# EAGLE design v1 (EAGLE 7.7.0)
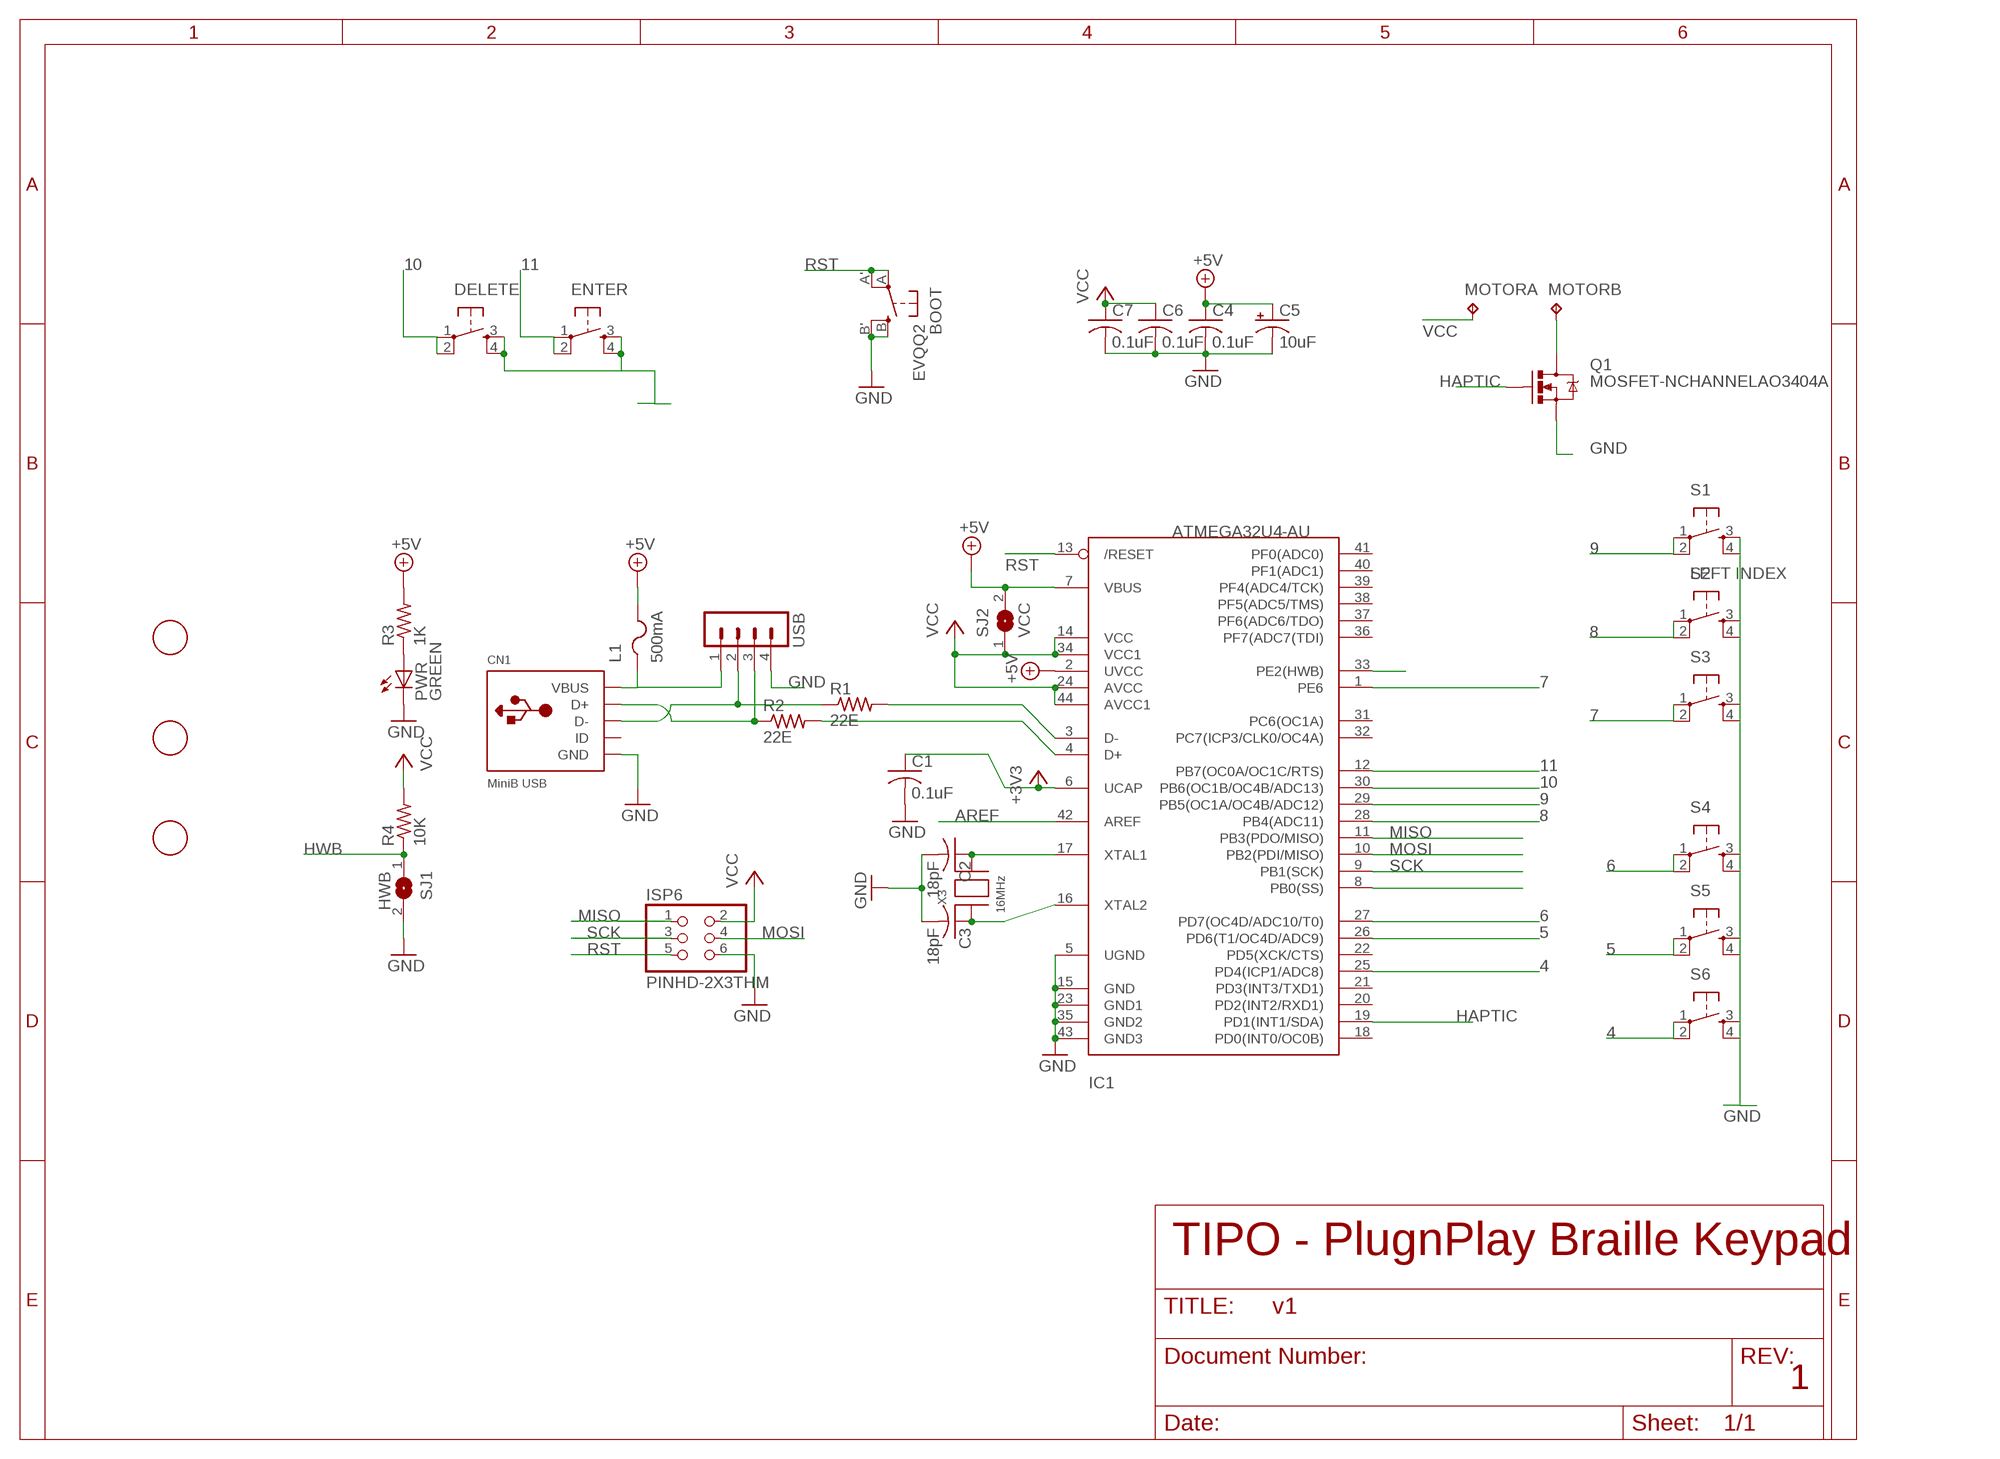
[diagram p0: schematic, sheet 1]

## Parts
BOOT  EVQQ2  [EVQ-Q2]
C1  0.1uF  C-USC0805K  [C0805K]
C2  18pF  C-USC0805K  [C0805K]
C3  18pF  C-USC0805K  [C0805K]
C4  0.1uF  C-USC0805K  [C0805K]
C5  10uF  CPOL-USA/3216-18R  [A/3216-18R]
C6  0.1uF  C-USC0805K  [C0805K]
C7  0.1uF  C-USC0805K  [C0805K]
CN1  MiniB USB  USBMINIB  [USB-MINIB]
DELETE  TAC_SWITCHPTH  [TACTILE-PTH]
ENTER  TAC_SWITCHPTH  [TACTILE-PTH]
IC1  ATMEGA32U4-AU  [TQFP44]
ISP6  PINHD-2X3THM  [ISP6]
L1  500mA  PTCFUSE-1206  [R1206]
MOTOR  TP2P2-38-17  [P2-38-17]
PWR  GREEN  LEDCHIPLED_0805  [CHIPLED_0805]
Q1  MOSFET-NCHANNELAO3404A  [SOT23-3]
R1  22E  R-US_R0805  [R0805]
R2  22E  R-US_R0805  [R0805]
R3  1K  R-US_R0805  [R0805]
R4  10K  R-US_R0805  [R0805]
S1  LEFT INDEX  TAC_SWITCHPTH  [TACTILE-PTH]
S2  TAC_SWITCHPTH  [TACTILE-PTH]
S3  TAC_SWITCHPTH  [TACTILE-PTH]
S4  TAC_SWITCHPTH  [TACTILE-PTH]
S5  TAC_SWITCHPTH  [TACTILE-PTH]
S6  TAC_SWITCHPTH  [TACTILE-PTH]
SJ1  HWB  SJ  [SJ]
SJ2  VCC  SJ  [SJ]
U$1  FIDUCIAL  [FIDUCIAL_1MM]
U$2  FIDUCIAL  [FIDUCIAL_1MM]
U$6  FIDUCIAL  [FIDUCIAL_1MM]
USB  MA04-1  [MA04-1]
X3  16MHz  XTALNX5032  [NX5032]

## Nets
4: IC1.25(PD4(ICP1/ADC8)) S6.1 S6.2
5: IC1.26(PD6(T1/OC4D/ADC9)) S5.1 S5.2
6: IC1.27(PD7(OC4D/ADC10/T0)) S4.1 S4.2
7: IC1.1(PE6) S3.1 S3.2
8: IC1.28(PB4(ADC11)) S2.1 S2.2
9: IC1.29(PB5(OC1A/OC4B/ADC12)) S1.1 S1.2
10: DELETE.1 DELETE.2 IC1.30(PB6(OC1B/OC4B/ADC13))
11: ENTER.1 ENTER.2 IC1.12(PB7(OC0A/OC1C/RTS))
+3V3: C1.1 IC1.6(UCAP)
+5V: C4.1 C5.+ IC1.2(UVCC) IC1.7(VBUS) L1.2 R3.2 SJ2.2
AREF: IC1.42(AREF)
GND: BOOT.B'(S1) BOOT.B(S) C1.2 C2.2 C3.2 C4.2 C5.- C6.2 C7.2 CN1.GND DELETE.3 DELETE.4 ENTER.3 ENTER.4 IC1.5(UGND) IC1.15(GND) IC1.23(GND1) IC1.35(GND2) IC1.43(GND3) ISP6.6 PWR.C Q1.2(S) S1.3 S1.4 S2.3 S2.4 S3.3 S3.4 S4.3 S4.4 S5.3 S5.4 S6.3 S6.4 SJ1.2 USB.4
HAPTIC: IC1.19(PD1(INT1/SDA)) Q1.1(G)
HWB: IC1.33(PE2(HWB)) R4.1 SJ1.1
MISO: IC1.11(PB3(PDO/MISO)) ISP6.1
MOSI: IC1.10(PB2(PDI/MISO)) ISP6.4
N$1: PWR.A R3.1
N$2: CN1.D+ R2.1 USB.3
N$3: IC1.3(D-) R1.2
N$4: IC1.4(D+) R2.2
N$5: CN1.D- R1.1 USB.2
N$7: MOTOR.TP-2 Q1.3(D)
N$8: C2.1 IC1.17(XTAL1) X3.P$2
N$9: C3.1 IC1.16(XTAL2) X3.P$1
PB0: IC1.8(PB0(SS))
RST: BOOT.A'(P1) BOOT.A(P) IC1.13(/RESET) ISP6.5
SCK: IC1.9(PB1(SCK)) ISP6.3
VBUS: CN1.VBUS L1.1 USB.1
VCC: C6.1 C7.1 IC1.14(VCC) IC1.24(AVCC) IC1.34(VCC1) IC1.44(AVCC1) ISP6.2 MOTOR.TP-1 R4.2 SJ2.1
Unconnected: CN1.ID IC1.18(PD0(INT0/OC0B)) IC1.20(PD2(INT2/RXD1)) IC1.21(PD3(INT3/TXD1)) IC1.22(PD5(XCK/CTS)) IC1.31(PC6(OC1A)) IC1.32(PC7(ICP3/CLK0/OC4A)) IC1.36(PF7(ADC7(TDI)) IC1.37(PF6(ADC6/TDO)) IC1.38(PF5(ADC5/TMS)) IC1.39(PF4(ADC4/TCK)) IC1.40(PF1(ADC1)) IC1.41(PF0(ADC0))

## Notes on the sheet
- TIPO - PlugnPlay Braille Keypad
- 1

## Library data of the parts
BOOT = adaprog:EVQQ2
C1-C4 C6 C7 = adafruit:C-US: CAPACITOR, American symbol
C5 = adafruit:CPOL-US: POLARIZED CAPACITOR, American symbol
CN1 = adafruit:USB: USB Connectors USBMINIB - Surface Mount Female Mini-B USB Connector 4UConnector: 06564 By microbuilder.eu Thru-hole RA Female Mini-B USB Connector 4UConnector: 18732 By ladyada.net
DELETE ENTER S1-S6 = SparkFun-Retired:TAC_SWITCH: Momentary Switch Button commonly used for reset or general input. Spark Fun Electronics SKU : COM-00097 SMT- SWCH-08247
IC1 = adaprog:ATMEGA32U4
ISP6 = adaprog:PINHD-2X3
L1 = adafruit:PTCFUSE: PTC fuses, resettable thermistors
MOTOR = testpad:TP2: Test pad
PWR = adafruit:LED: LED OSRAM: - CHIPLED LG R971, LG N971, LY N971, LG Q971, LY Q971, LO R971, LY R971 LH N974, LH R974 LS Q976, LO Q976, LY Q976 LO Q996 - Hyper CHIPLED LW Q18S LB Q993, LB Q99A, LB R99A - SideLED LS A670, LO A670, LY A670, LG A670, LP A670 LB A673, LV A673, LT A673, LW A673 LH A674 LY A675 LS A676, LA A676, LO A676, LY A676, LW A676 LS A679, LY A679, LG A679 - Hyper Micro SIDELED® LS Y876, LA Y876, LO Y876, LY Y876 LT Y87S - SmartLED LW L88C, LW L88S LB L89C, LB L89S, LG L890 LS L89K, LO L89K, LY L89K LS L896, LA L896, LO L896, LY L896 - TOPLED LS T670, LO T670, LY T670, LG T670, LP T670 LSG T670, LSP T670, LSY T670, LOP T670, LYG T670 LG T671, LOG T671, LSG T671 LB T673, LV T673, LT T673, LW T673 LH T674 LS T676, LA T676, LO T676, LY T676, LB T676, LH T676, LSB T676, LW T676 LB T67C, LV T67C, LT T67C, LS T67K, LO T67K, LY T67K, LW E67C LS E67B, LA E67B, LO E67B, LY E67B, LB E67C, LV E67C, LT E67C LW T67C LS T679, LY T679, LG T679 LS T770, LO T770, LY T770, LG T770, LP T770 LB T773, LV T773, LT T773, LW T773 LH T774 LS E675, LA E675, LY E675, LS T675 LS T776, LA T776, LO T776, LY T776, LB T776 LHGB T686 LT T68C, LB T68C - Hyper Mini TOPLED® LB M676 - Mini TOPLED Santana® LG M470 LS M47K, LO M47K, LY M47K Source: http://www.osram.convergy.de/
Q1 = SparkFun-DiscreteSemi:MOSFET-NCHANNEL: Common NMOSFET Parts MFG P/N Store ID Prod ID FDD8780 TRANS-09984 SI7820DN TRANS-11055 FDS6630A IC-08089 2N7002PW TRANS-11151 FQP30N06L COM-10213 TRANS-10060 BSS123LT1G TRANS-08345 BSS138 TRANS-00830 BS170 2N7000; PROD_ID: TRAN-12988
R1-R4 = adafruit:R-US_: RESISTOR, American symbol
SJ1 SJ2 = jumper:SJ: SMD solder JUMPER
U$1 U$2 U$6 = adafruit:FIDUCIAL: For use by pick and place machines to calibrate the vision/machine, 1mm By microbuilder.eu
USB = con-lstb:MA04-1: PIN HEADER; OC_FARNELL: unknown; OC_NEWARK: unknown
X3 = adaprog:XTAL

## Board
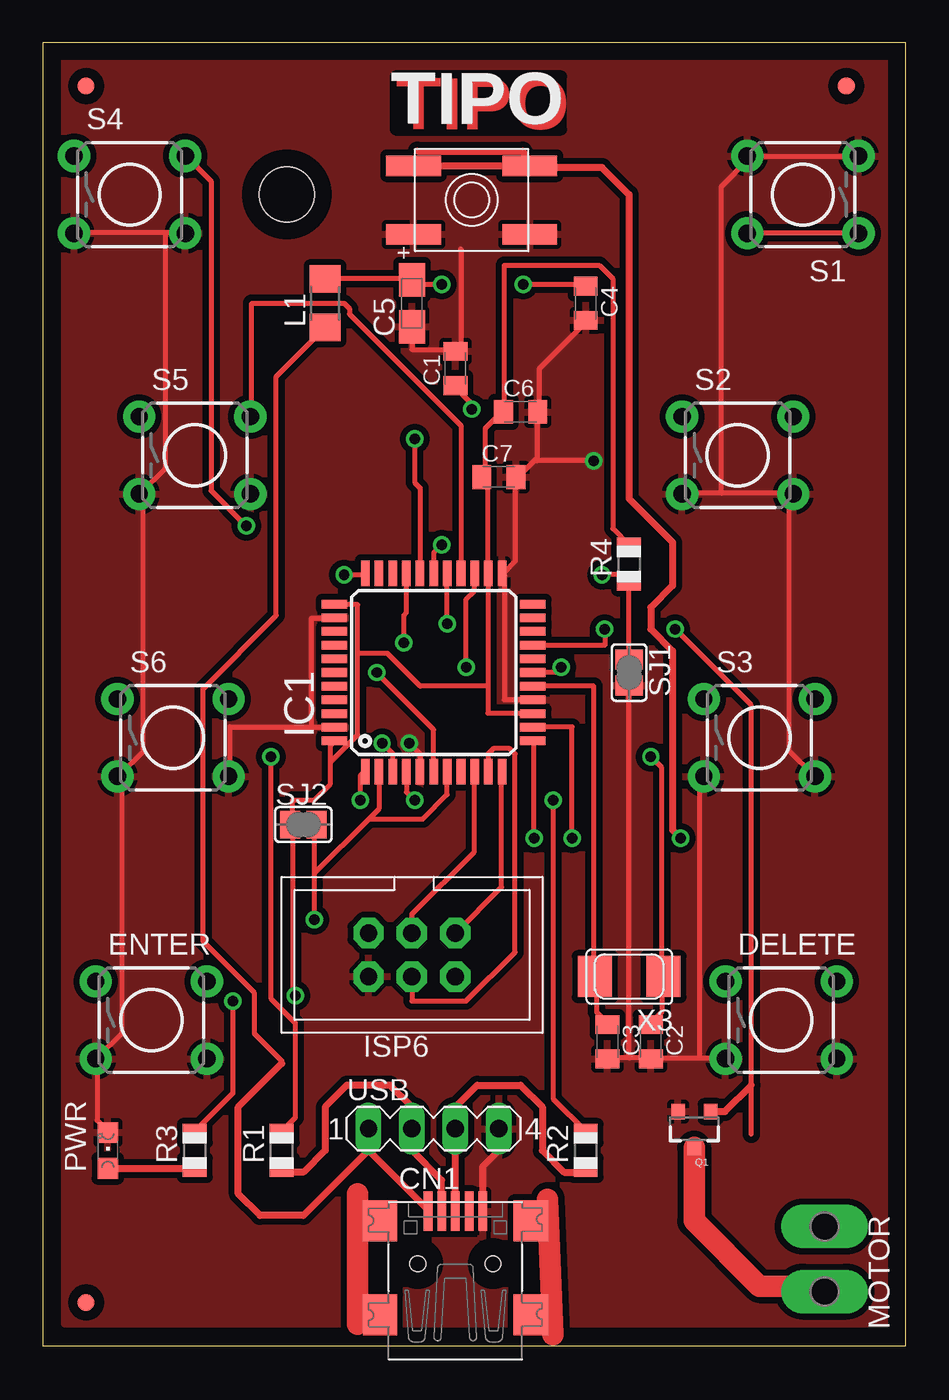
[diagram p1: board, top side]
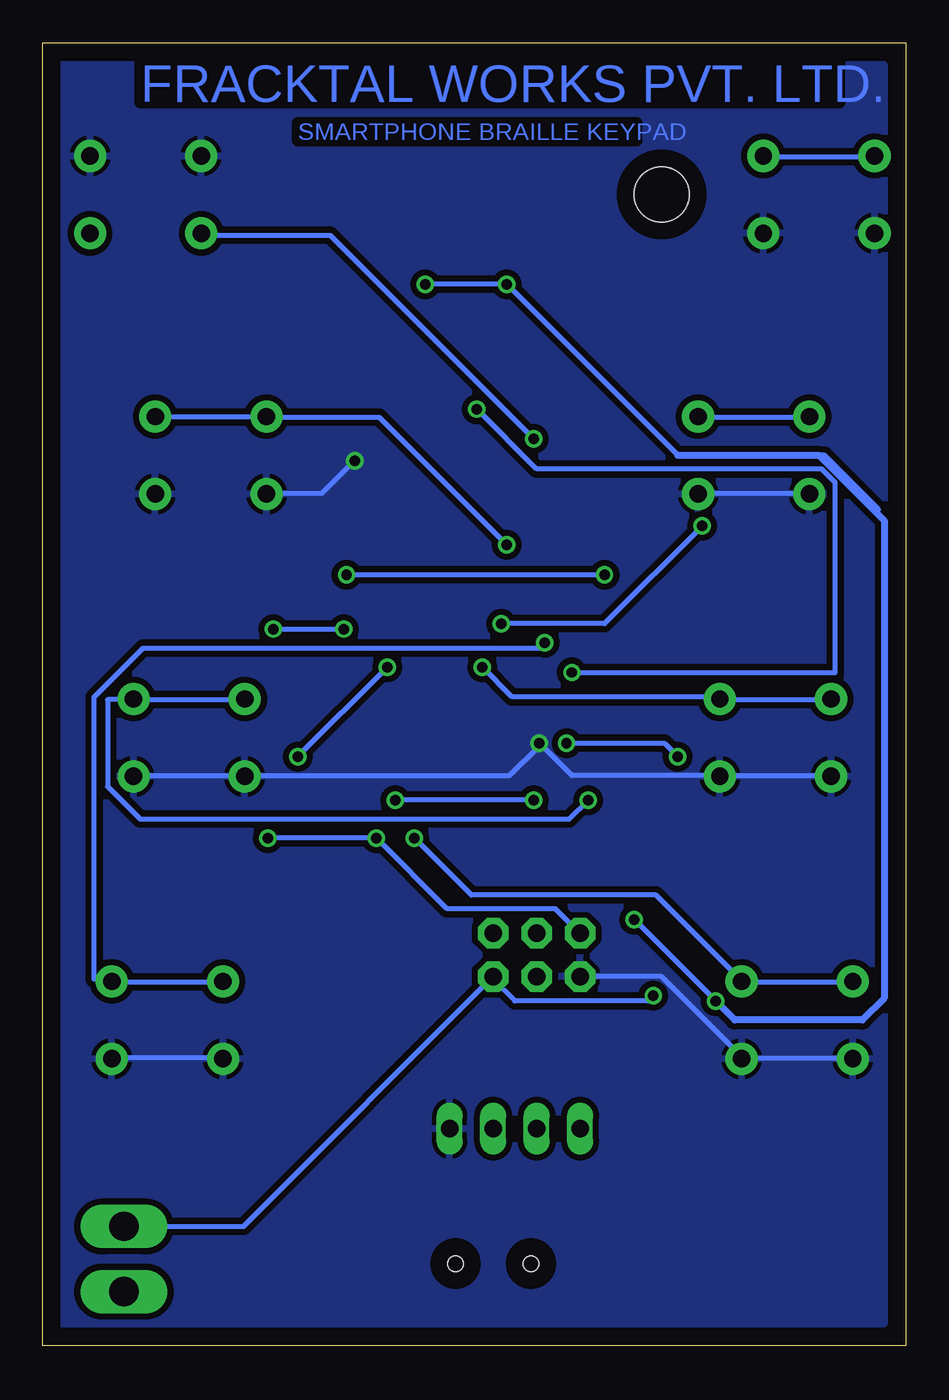
[diagram p2: board, bottom side, seen from below]

Size 50.47 x 76.19 mm. Coordinates in mm from the lower left corner, seen from the top.
Outline: 0,0 50.47,0 50.47,76.19 0,76.19 0,0
Copper layers (1*16): Top 0.035mm / dielectric 1.5mm / Bottom 0.035mm
Design rules "default *": minimum track width 12mil, minimum drill 24mil, track to track 14mil, track to pad 14mil, pad to pad 14mil, via to via 14mil, smd to smd 1mil, copper to edge 40mil, drill to drill 8mil, minimum pad ring 10mil, minimum via ring 8mil, stop-mask expansion 4mil, vias tented up to drill 0mil, thermal gap 10mil
Holes 3.2 mm at 14.29,67.31

### Footprints (pad centres in the part's own frame; a part is rotated, then mirrored left to right if it is on the bottom)
EVQ-Q2 = smd 3.2 x 1.2: A -3.4,-2; A' 3.4,-2; B -3.4,2; B' 3.4,2
C0805K = smd 1.1 x 1.4: 1 -1,0; 2 1,0
A/3216-18R = smd 1.95 x 1.5: + 1.375,0; - -1.375,0
USB-MINIB = smd 0.5 x 2.308: D+ 0,4.064; D- -0.8,4.064; GND 1.6,4.064; ID 0.8,4.064; VBUS -1.6,4.064 | smd 2 x 2.4: GND1 -4.4,-2; GND2 -4.4,3.5; GND3 4.4,3.5; GND4 4.4,-2 | hole 0.9: -2.2,1; 2.2,1
TACTILE-PTH = drill 1.016 pad 1.88: 1 -3.251,2.261; 2 3.251,2.261; 3 -3.251,-2.261; 4 3.251,-2.261
TQFP44 = smd 1.5 x 0.5: 1 -5.8,4; 2 -5.8,3.2; 3 -5.8,2.4; 4 -5.8,1.6; 5 -5.8,0.8; 6 -5.8,0; 7 -5.8,-0.8; 8 -5.8,-1.6; 9 -5.8,-2.4; 10 -5.8,-3.2; 11 -5.8,-4; 23 5.8,-4; 24 5.8,-3.2; 25 5.8,-2.4; 26 5.8,-1.6; 27 5.8,-0.8; 28 5.8,0; 29 5.8,0.8; 30 5.8,1.6; 31 5.8,2.4; 32 5.8,3.2; 33 5.8,4 | smd 0.5 x 1.5: 12 -4,-5.8; 13 -3.2,-5.8; 14 -2.4,-5.8; 15 -1.6,-5.8; 16 -0.8,-5.8; 17 0,-5.8; 18 0.8,-5.8; 19 1.6,-5.8; 20 2.4,-5.8; 21 3.2,-5.8; 22 4,-5.8; 34 4,5.8; 35 3.2,5.8; 36 2.4,5.8; 37 1.6,5.8; 38 0.8,5.8; 39 0,5.8; 40 -0.8,5.8; 41 -1.6,5.8; 42 -2.4,5.8; 43 -3.2,5.8; 44 -4,5.8
ISP6 = drill 1.016 pad 1.778 octagon: 1 -2.54,-1.27; 2 -2.54,1.27; 3 0,-1.27; 4 0,1.27; 5 2.54,-1.27; 6 2.54,1.27
R1206 = smd 1.6 x 1.803: 1 -1.422,0; 2 1.422,0
P2-38-17 = drill 1.702 pad 2.121 long: TP-1 -1.905,0; TP-2 1.905,0
CHIPLED_0805 = smd 1.2 x 1.2: A 0,-1.05; C 0,1.05
SOT23-3 = smd 0.8 x 0.9: 1 -0.95,-1; 2 0.95,-1; 3 0,1.1
R0805 = smd 1.1 x 1.4: 1 -1,0; 2 1,0
SJ = smd 1.168 x 1.6: 1 -0.762,0; 2 0.762,0
FIDUCIAL_1MM = smd 1 x 1: 1 0,0
MA04-1 = drill 1.016 long: 1 -3.81,0; 2 -1.27,0; 3 1.27,0; 4 3.81,0
NX5032 = smd 2 x 2.4: P$1 2,0; P$2 -2,0

### Placement (x,y rotation side)
BOOT  25.08,66.99 180 top
C1  24.13,57.15 90 top
C2  35.56,17.78 270 top
C3  33.02,17.78 270 top
C4  31.75,60.96 270 top
C5  21.59,60.96 90 top
C6  27.94,54.61 0 top
C7  26.67,50.8 0 top
CN1  24.13,3.81 0 top
DELETE  43.18,19.05 0 top
ENTER  6.35,19.05 0 top
IC1  22.86,39.37 90 top
ISP6  21.59,22.86 180 top
L1  16.51,60.96 90 top
MOTOR  45.72,5.08 270 top
PWR  3.81,11.43 0 top
Q1  38.1,12.7 180 top
R1  13.97,11.43 90 top
R2  31.75,11.43 90 top
R3  8.89,11.43 90 top
R4  34.29,45.72 90 top
S1  44.45,67.31 180 top
S2  40.64,52.07 0 top
S3  41.91,35.56 0 top
S4  5.08,67.31 0 top
S5  8.89,52.07 0 top
S6  7.62,35.56 0 top
SJ1  34.29,39.37 270 top
SJ2  15.24,30.48 0 top
U$1  2.54,73.66 0 top
U$2  46.99,73.66 0 top
U$6  2.54,2.54 0 top
USB  22.86,12.7 0 top
X3  34.29,21.59 180 top

### Tracks (layer width: path | path; a pad name or v marks a point on that pad's centre or on a via)
4  (via drill 0.61)
  Top 0.305: v24.77,39.69 24.77,43.66 25.24,44.13 25.24,45.09 IC1.25
  Bottom 0.305: v24.77,39.69 23.02,37.94 10.95,37.94 S6.2 10.79,37.78 4.45,37.78 S6.1
5
  Top 0.305: IC1.26 24.45,45.24 24.45,53.82 17.94,60.33 17.94,60.64 17.62,60.96 12.22,60.96 12.22,54.45 S5.2
  Bottom 0.305: S5.1 5.71,54.29 12.06,54.29 S5.2
6  (via drill 0.61)
  Top 0.305: v23.65,42.23 23.65,45.09 IC1.27 | v11.91,47.94 9.84,50.01 9.84,68.1 8.41,69.53 S4.2
  Bottom 0.305: v23.65,42.23 17.62,42.23 v11.91,47.94 | S4.1 1.91,69.53 8.26,69.53 S4.2
7  (via drill 0.61)
  Top 0.305: v18.57,31.91 18.57,33.34 18.73,33.5 IC1.1
  Bottom 0.305: v18.57,31.91 19.68,30.8 44.77,30.8 46.67,32.7 46.67,37.78 45.24,37.78 S3.2 45.09,37.78 38.73,37.78 S3.1
8  (via drill 0.61)
  Top 0.305: IC1.28 22.86,46.35 v23.34,46.83
  Bottom 0.305: v23.34,46.83 30.8,54.29 37.31,54.29 S2.1 37.47,54.29 43.81,54.29 S2.2
9  (via drill 0.61)
  Top 0.305: v21.75,53.02 21.75,50.48 22.07,50.16 22.07,45.24 IC1.29 | S1.1 47.62,65.09 41.27,65.09 S1.2
  Bottom 0.305: v21.75,53.02 33.66,64.93 41.12,64.93 S1.2
10  (via drill 0.61)
  Top 0.305: v21.11,41.12 21.11,42.7 21.27,42.86 21.27,45.09 IC1.30
  Bottom 0.305: v21.11,41.12 21.43,40.8 44.61,40.8 47.47,37.94 47.47,21.43 46.51,21.43 DELETE.2 46.35,21.27 40.01,21.27 DELETE.1
11  (via drill 0.61)
  Top 0.305: v28.73,29.69 28.73,35.24 IC1.12
  Bottom 0.305: v28.73,29.69 25.4,26.35 14.61,26.35 9.68,21.43 ENTER.2 9.53,21.27 3.17,21.27 ENTER.1
+3V3  (via drill 0.61)
  Top 0.305: v25.08,54.77 25.08,55.09 24.13,56.04 C1.1 | v19.53,39.37 22.86,36.04 IC1.6
  Bottom 0.305: v25.08,54.77 21.59,51.28 4.92,51.28 4.13,50.48 4.13,39.37 v19.53,39.37
+5V  (via drill 0.61)
  Top 0.305: v28.1,62.07 31.75,62.07 C4.1 | v23.34,62.07 21.59,62.07 C5.+ 21.59,62.39 L1.2 | v11.11,20.16 11.11,14.76 8.89,12.54 R3.2 | 15.88,27.62 15.88,30.48 SJ2.2 | 15.88,27.62 v15.88,24.92 | 15.88,27.62 19.13,30.88 | 19.13,30.88 19.68,31.43 19.68,33.5 IC1.2 | IC1.7 23.65,33.5 23.65,32.23 22.23,30.8 19.21,30.8 19.13,30.88
  Bottom 0.305: v28.1,62.07 v23.34,62.07 13.34,52.07 4.76,52.07 1.59,48.9 | v15.88,24.92 v11.11,20.16 10.79,19.84
  Bottom 0.406: 13.34,52.07 5.08,52.07 1.27,48.26 1.27,20.32 2.54,19.05 10,19.05 v11.11,20.16
GND  (via drill 0.61)
  Top 0.305: 24.13,58.26 21.59,58.26 C5.- | 24.13,58.26 24.45,58.58 24.45,64.14 | 24.13,58.26 C1.2 | 7.14,65.09 8.26,65.09 S4.4 | 7.14,65.09 1.91,65.09 S4.3 | 7.14,65.09 7.14,51.28 5.71,49.85 S5.3 5.71,49.69 5.87,49.53 5.87,34.77 4.45,33.34 S6.3 4.45,33.18 4.6,33.02 4.6,18.26 3.17,16.83 ENTER.3 3.17,16.67 3.17,13.18 3.81,12.54 PWR.C | v21.43,35.24 22.07,34.61 22.07,33.66 IC1.5 | 15.72,36.2 10.95,36.2 10.95,33.34 S6.4 | 15.72,36.2 16.99,36.2 IC1.43 | 15.72,36.2 15.72,42.55 16.99,42.55 IC1.35 | 28.81,51.83 28.89,51.91 28.89,54.61 C6.2 29.05,54.61 29.05,57.15 31.75,59.85 C4.2 | 28.81,51.83 27.78,50.8 C7.2 27.62,50.8 27.62,45.88 26.99,45.24 IC1.23 26.99,45.09 26.99,37.78 28.57,37.78 IC1.15 | S1.3 47.62,69.53 41.27,69.53 S1.4 41.27,69.37 39.69,67.79 39.69,49.85 | 39.69,49.85 43.81,49.85 S2.4 43.81,49.69 43.66,49.53 43.66,34.77 45.09,33.34 S3.4 | 39.69,49.85 37.47,49.85 S2.3 | 35.56,16.83 34.29,16.83 | 34.29,16.83 33.02,16.83 C3.2 | 34.29,16.83 SJ1.2 | 35.56,16.83 38.42,16.83 | 38.42,16.83 39.85,16.83 DELETE.3 | 35.56,16.83 C2.2 | 38.42,16.83 38.42,33.02 38.58,33.18 S3.3 | v32.23,51.75 28.89,51.75 28.81,51.83
  Top 0.406: CN1.GND 25.73,10.49 26.67,11.43 USB.4
  Bottom 0.305: S5.3 5.71,49.85 12.06,49.85 S5.4 | ISP6.6 14.29,21.59 9.53,16.83 ENTER.4 9.37,16.83 3.17,16.83 ENTER.3 | S6.3 4.45,33.34 10.79,33.34 S6.4 10.95,33.34 19.53,33.34 v21.43,35.24 21.43,35.08 23.18,33.34 38.58,33.34 S3.3 38.73,33.34 45.09,33.34 S3.4 | DELETE.4 46.35,16.83 40.01,16.83 DELETE.3 | v32.23,51.75 34.13,49.85 37.31,49.85 S2.3
  pour Top: 1.27,75.56 49.53,75.56 49.53,1.27 1.27,1.27
  pour Bottom: 1.27,74.93 1.27,1.27 49.53,1.27 49.53,74.93
HAPTIC  (via drill 0.61)
  Top 0.305: v32.86,41.91 32.86,40.96 28.73,40.96 IC1.19 | v36.99,41.91 41.43,37.47 41.43,15.24 41.43,12.38
  Top 0.406: Q1.1 39.89,13.7 41.43,15.24
  Bottom 0.305: v36.99,41.91 v32.86,41.91
HWB  (via drill 0.61)
  Top 0.305: SJ1.1 R4.1 34.29,45.09 v32.7,45.09 | v17.62,45.09 18.73,45.09 IC1.33
  Bottom 0.305: v32.7,45.09 v17.62,45.09
MISO
  Top 0.305: ISP6.1 26.83,26.83 26.83,33.5 IC1.11
MOSI
  Top 0.305: ISP6.4 21.59,20.16 24.77,20.16 27.62,23.02 27.62,34.61 27.3,34.92 26.35,34.92 26.04,34.61 26.04,33.66 IC1.10
N$1
  Top 0.406: PWR.A 8.84,10.38 R3.1
N$2
  Top 0.406: CN1.D+ USB.3 24.13,13.97 25.4,15.24 27.94,15.24 29.21,13.97 29.21,11.43 30.48,10.16 31.48,10.16 R2.1
N$3  (via drill 0.61)
  Top 0.305: v13.34,34.45 13.34,20.32 14.76,18.89 14.76,13.34 13.97,12.54 R1.2 | v19.84,35.24 20.48,34.61 20.48,33.66 IC1.3
  Bottom 0.305: v13.34,34.45 14.13,35.24 v19.84,35.24
N$4  (via drill 0.61)
  Top 0.305: v29.84,31.91 29.84,14.45 31.75,12.54 R2.2 | v21.75,31.91 21.27,32.38 21.27,33.5 IC1.4
  Bottom 0.305: v21.75,31.91 v29.84,31.91
N$5
  Top 0.406: CN1.D- 23.33,9.69 21.59,11.43 USB.2 21.59,13.97 20.32,15.24 17.78,15.24 16.51,13.97 16.51,11.43 15.24,10.16 14.24,10.16 R1.1
N$6
  Top 1.27: 18.41,8.89 18.41,1.27
N$7
  Top 1.27: Q1.3 38.1,7.3 41.91,3.49 45.4,3.49 MOTOR.TP-2
N$8  (via drill 0.61)
  Top 0.305: 36.2,21.59 36.2,19.53 35.56,18.89 C2.1 | IC1.17 30.32,39.37 v30.32,39.69 | v35.56,34.45 36.2,33.81 36.2,21.59 | 36.2,21.59 X3.P$2
  Bottom 0.305: v35.56,34.45 v30.32,39.69
N$9
  Top 0.305: C3.1 33.02,18.89 32.38,19.53 32.38,21.59 X3.P$1 32.23,21.59 32.23,38.58 28.73,38.58 IC1.16
N$10
  Top 1.27: 29.53,8.57 29.84,0.64
RST  (via drill 0.61)
  Top 0.305: v30.96,29.69 30.96,36.2 28.73,36.2 IC1.13 | v37.31,29.69 37.15,29.84
  Top 0.406: v37.31,29.69 36.83,30.16 36.83,40.64 35.56,41.91 35.56,43.18 36.83,44.45 36.83,46.99 34.29,49.53 34.29,67.31 32.7,68.9 29.21,68.9 28.89,69.22 28.7,69.22 BOOT.A | 21.91,69.85 28.07,69.85 BOOT.A | BOOT.A' BOOT.A
  Bottom 0.305: ISP6.5 20.48,25.56 26.83,25.56 v30.96,29.69 v37.31,29.69
SCK
  Top 0.305: ISP6.3 21.59,25.24 25.24,28.89 25.24,33.5 IC1.9
VBUS
  Top 0.305: L1.1 13.65,56.67 13.65,42.7 9.37,38.42 9.37,23.65 12.38,20.64 12.38,18.26 13.97,16.67 13.97,16.51
  Top 0.406: CN1.VBUS 22.53,7.95 19.05,11.43 | USB.1 19.05,11.43 | 19.05,11.43 15.24,7.62 12.7,7.62 11.43,8.89 11.43,13.97 13.97,16.51
VCC  (via drill 0.61)
  Top 0.305: 16.83,34.13 16.83,32.86 15.88,31.91 14.61,31.91 14.61,30.48 | 16.83,34.13 16.83,35.08 16.99,35.24 IC1.44 | 18.41,40.48 18.41,35.72 16.83,34.13 | 18.41,40.48 18.41,43.34 17.14,43.34 IC1.34 | R4.2 34.29,46.83 33.34,47.78 33.34,62.39 32.54,63.18 26.99,63.18 26.99,54.61 C6.1 26.83,54.61 25.88,53.66 25.88,50.8 C7.1 25.72,50.8 26.04,50.48 26.04,45.24 IC1.24 26.04,45.09 26.04,38.58 | 26.04,38.58 26.04,36.99 28.57,36.99 IC1.14 | 18.41,40.48 20.16,40.48 22.07,38.58 26.04,38.58 | v14.76,20.48 14.61,20.64 14.61,30.48 | 14.61,30.48 SJ2.1
  Bottom 0.305: MOTOR.TP-1 38.73,6.99 ISP6.2 24.13,21.43 22.86,20.16 15.08,20.16 v14.76,20.48

### Text on the board
Top: TIPO
Bottom: FRACKTAL WORKS PVT. LTD. | SMARTPHONE BRAILLE KEYPAD
tPlace: TIPO